# Altium schematic sheet canbus.SchDoc
size A4; SheetNumber: 6; SheetTotal: 6
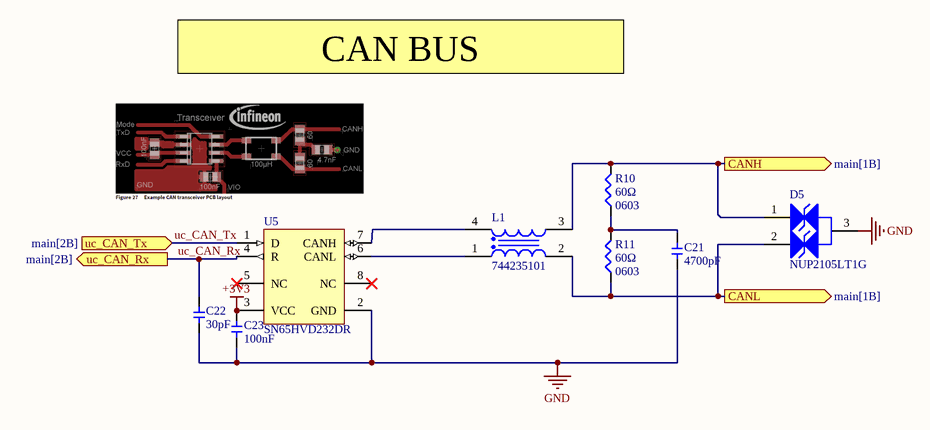
[diagram p0: canbus.SchDoc]

## Parts
C21  value 4700pF  [0603_cap]  (hidden comment: 0603_4700pF)
C22  value 30pF  [0603_cap]  (hidden comment: 0603_30pF)
C23  value 100nF  [0603_cap]  (hidden comment: 0603_100nF)
D5  NUP2105LT1G  [ONSC-SOT-23-3-318-08_V]
L1  744235101  [WE-CNSW_1812]
R10  value 60Ω  Package: 0603  [0603-smd]  (hidden comment: 0603_60R)
R11  value 60Ω  Package: 0603  [0603-smd]  (hidden comment: 0603_60R)
U5  SN65HVD232DR  [D0008A_M]

## Ports
CANH (out, see main[1B]), CANL (out, see main[1B]), uc_CAN_Rx (out, see main[2B]), uc_CAN_Tx (in, see main[2B])

## Nets
+3V3: C23.2 U5.3(VCC)
GND: C21.1 C22.1 C23.1 D5.3(K) U5.2(GND)
CANH: D5.1(K) L1.3 R10.2 ; port CANH
CANL: D5.2(K) L1.2 R11.1 ; port CANL
uc_CAN_Rx: C22.2 U5.4(R) ; port uc_CAN_Rx
uc_CAN_Tx: U5.1(D) ; port uc_CAN_Tx
NetC21_2: C21.2 R10.1 R11.2
NetL1_1: L1.1 U5.6(CANL)
NetL1_4: L1.4 U5.7(CANH)

Not connected (* = marked no-connect by the designer): U5 5(NC)* 8(NC)*

## Notes on the sheet
- CAN BUS
- Title:
- Drawn By:
- Page Contents:
- Size:
- Date:
- License:
- Email:
- A4
- Number:
- Time:
- Revision:
- Sheet
- of

## Library data of the parts
C21 = 0603_4700pF: Volt: V; Package: 0603
C22 = 0603_30pF: Volt: V; Package: 0603
C23 = 0603_100nF: Volt: V; Package: 0603
D5 = CMP-1063-00164-1: Dual Line CAN Bus Protector, 3-Pin SOT-23, Pb-Free, Tape and Reel; Manufacturer: On Semiconductor; IR Max (uA): 0.1; Number of Lines: 2; Direction: Bidirectional; C Max (pF): 30; PPK Max (W): 350; V(BR) Min (V): 26.2; ComponentLink3URL: http://www.onsemi.cn/pub_link/Collateral/318-08.PDF; Mounting Technology: Surface Mount; ComponentLink2Description: Datasheet; PartNumber: NUP2105LT1G; ComponentLink1URL: http://www.onsemi.com/; PackageVersion: Rev. AP, 11/2009; DatasheetVersion: Rev. 5; RoHS: Pb-Free; PackageReference: SOT-23-3-318-08; ComponentLink2URL: http://www.onsemi.cn/pub_link/Collateral/NUP2105L-D.PDF; ComponentLink1Description: Manufacturer URL; PackageDescription: 3-Pin Small Outline Transistor, Body 2.92 x 1.3 mm, Pitch 0.95 mm; Packing: Tape and Reel; ComponentLink3Description: Package Specification
L1 = CMP-207849-000010-2: CMC 100UH 150MA 2LN 8 KOHM SMD; NexarPartId: 61645269; Inductance: 100µH; Number of Lines: 2; DC Resistance (DCR): 2Ω; Voltage Rating (DC): 60V; Test Frequency: 100kHz; Max Current Rating: 150mA; RoHS: Compliant; Packaging: Tape & Reel (TR); Ambient Temperature Range Low: -40°C; Number of Pins: 4; Ambient Temperature Range High: 85°C; Min Operating Temperature: -40°C; Height: 2.8mm; RMS Current (Irms): 150mA; Width: 3.2mm; Current Rating: 150mA; Mount: Surface Mount; Max Operating Temperature: 125°C; Composition: Wirewound; Length: 4.5mm; Series Resistance: 2Ω; Voltage Rating: 60V
R10 R11 = 0603_60R: Power: W
U5 = CMP-0315-00075-2: 3.3 V Can Transceiver, 17 mA, -40 to 85 degC, 8-pin SOIC (D), Green (RoHS & no Sb/Br); Manufacturer: Texas Instruments; Supply Voltage(s)(V): 3.3; Receivers Per Package: 1; ICC(Max)(mA): 17; Rating: Catalog; Transient Pulse Protection(V): -25 to 25; Mounting Technology: Surface Mount; PartNumber: SN65HVD232DR; Code_JEDEC: MS-012AA; Eco-Plan: Green (RoHS & no Sb/Br); Isolated: No; SubFamily: CAN; Footprint: SN65HVD232; Drivers Per Package: 1; ComponentLink1URL: http://www.ti.com/general/docs/lit/getliterature.tsp?genericPartNumber=SN65HVD232&fileType=pdf; ComponentLink1Description: Datasheet; PackageDescription: 8-Pin Plastic Small Outline Integrated Circuit, 4.9 x 3.9 mm, Pitch 1.27 mm Pitch; PackageReference: D0008A; DatasheetVersion: SLOS346K; PackageVersion: revM, Jun-2011